# Altium schematic sheet USB to Serial Connector A.SchDoc
size A4
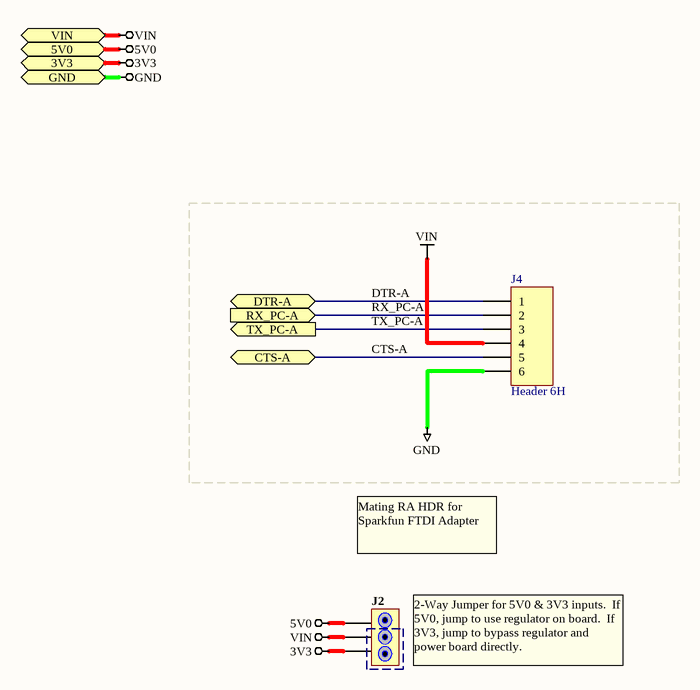
[diagram p0: USB to Serial Connector A.SchDoc]

## Parts
J2  3-WAY JUMPER  [HDR1X3]  (value not drawn)
J4  Header 6H  [HDR1X6H]

## Ports
3V3, 5V0, CTS-A, DTR-A, GND, RX_PC-A (in), TX_PC-A (out), VIN

## Nets
3V3: J2.1 ; port 3V3
5V0: J2.3 ; port 5V0
GND: J4.6 ; port GND
VIN: J2.2 J4.4 ; port VIN
CTS-A: J4.5 ; port CTS-A
DTR-A: J4.1 ; port DTR-A
RX_PC-A: J4.2 ; port RX_PC-A
TX_PC-A: J4.3 ; port TX_PC-A

## Notes on the sheet
- Mating RA HDR for Sparkfun FTDI Adapter
- (near J2) 2-Way Jumper for 5V0 & 3V3 inputs.  If 5V0, jump to use regulator on board.  If 3V3, jump to bypass regulator and power board directly.

## Library data of the parts
J2 = 3-WAY JUMPER: 3-Way Jumper - Center Output
J4 = Header 6H: Header, 6-Pin, Right Angle; LatestRevisionDate: 17-Jul-2002; LatestRevisionNote: Re-released for DXP Platform.; Publisher: Altium Limited